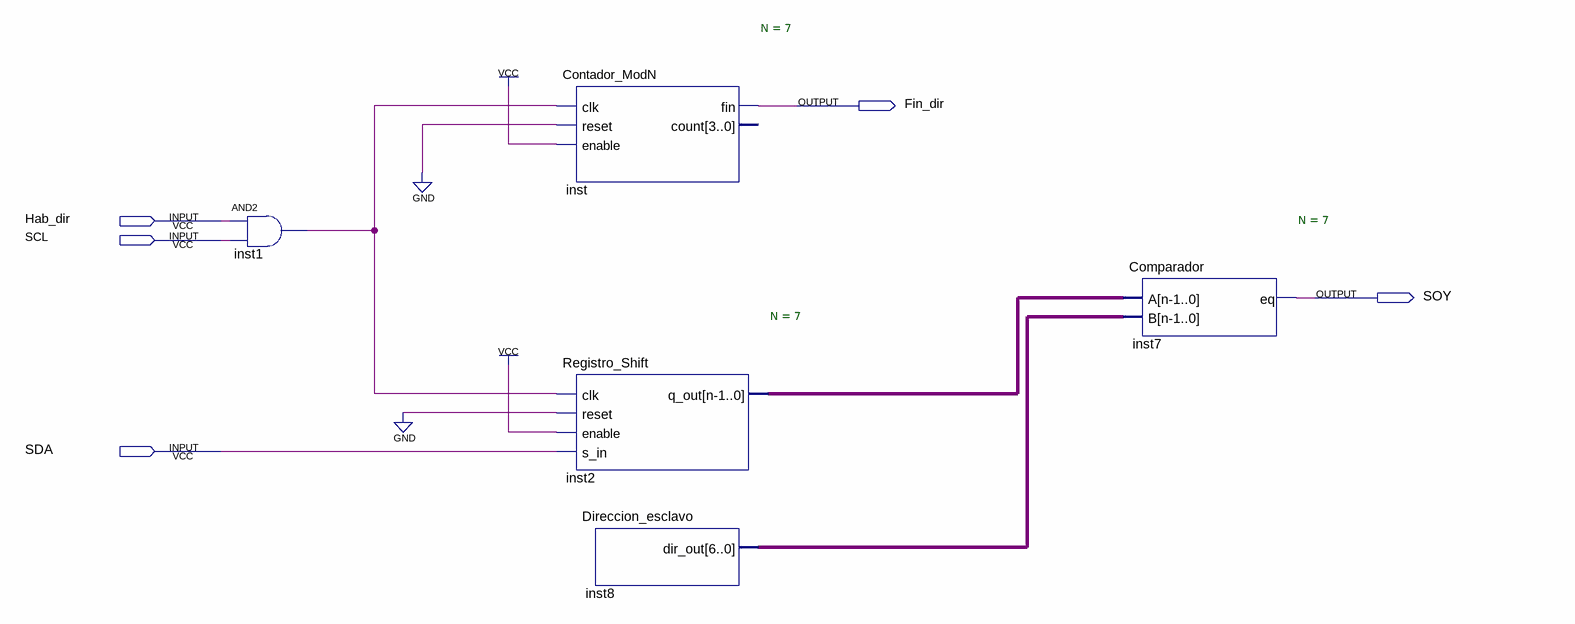
[diagram p0: schematic sheet]
// Quartus schematic CompDIR.bdf as structural Verilog: 5 symbols, 5 pins
module CompDIR (
  input  Hab_dir,
  input  SCL,
  input  SDA,
  output Fin_dir,
  output SOY
);

  wire inst1_out;
  wire [6:0] inst2_q_out, inst8_dir_out;

  and inst1 (inst1_out, Hab_dir, SCL);
  Contador_ModN #(.N(7)) inst (.clk(inst1_out), .reset(1'b0), .enable(1'b1), .fin(Fin_dir));  // open: count
  Registro_Shift #(.N(7)) inst2 (.clk(inst1_out), .reset(1'b0), .enable(1'b1), .s_in(SDA), .q_out(inst2_q_out));
  Direccion_esclavo inst8 (.dir_out(inst8_dir_out));
  Comparador #(.N(7)) inst7 (.A(inst2_q_out), .B(inst8_dir_out), .eq(SOY));
endmodule
